# Altium schematic sheet mach.SchDoc
size A
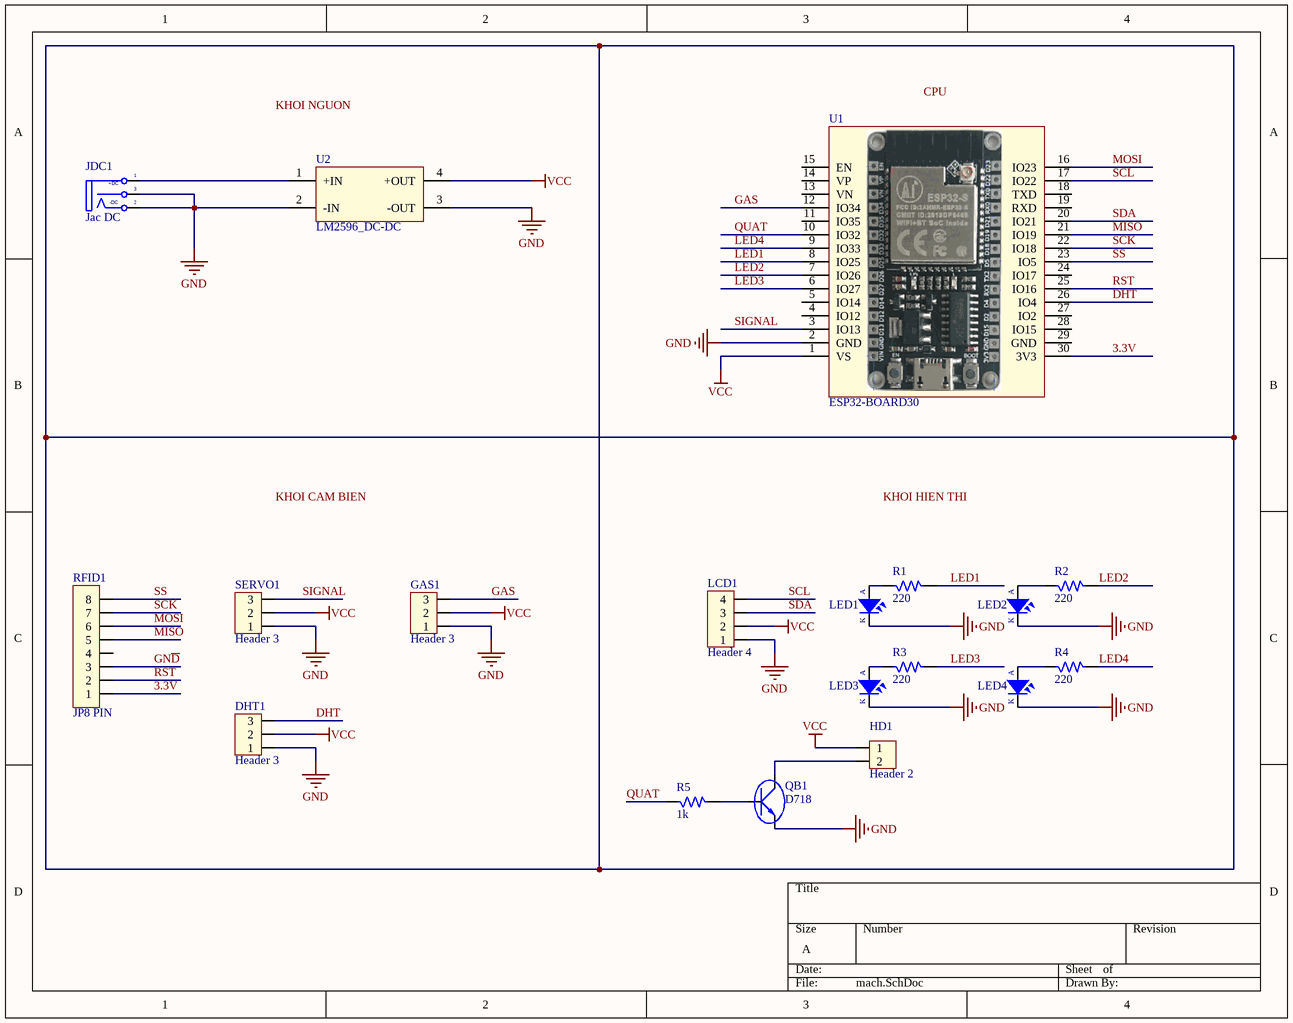
[diagram p0: mach.SchDoc]

## Parts
DHT1  Header 3  [HED3]
GAS1  Header 3  [HED3]
HD1  Header 2  [HED2]
JDC1  Jac DC  [DC-IN]
LCD1  Header 4  [KF8500-4P]
LED1  (no value)  [LED-5]
LED2  (no value)  [LED-5]
LED3  (no value)  [LED-5]
LED4  (no value)  [LED-5]
QB1  D718  [QTO-247]
R1  220  [RM-0805]
R2  220  [RM-0805]
R3  220  [RM-0805]
R4  220  [RM-0805]
R5  1k  [RM-0805]
RFID1  JP8 PIN  [JP8]
SERVO1  Header 3  [HED3]
U1  ESP32-BOARD30  [ESP32-BOARD30-900]
U2  LM2596_DC-DC  [LM2596-DCDC]

## Nets
GND: DHT1.1 GAS1.1 JDC1.2(TN) JDC1.3(S) LCD1.1 LED1.2(K) LED2.2(K) LED3.2(K) LED4.2(K) QB1.3(E) SERVO1.1 U1.2(GND) U2.2(-IN) U2.3(-OUT)
VCC: DHT1.2 GAS1.2 HD1.1 LCD1.2 SERVO1.2 U1.1(VS) U2.4(+OUT)
3.3V: RFID1.1 U1.30(3V3)
DHT: DHT1.3 U1.26(IO4)
GAS: GAS1.3 U1.12(IO34)
GN~{D}: RFID1.3
LED1: R1.2 U1.8(IO25)
LED2: R2.2 U1.7(IO26)
LED3: R3.2 U1.6(IO27)
LED4: R4.2 U1.9(IO33)
MISO: RFID1.5 U1.21(IO19)
MOSI: RFID1.6 U1.16(IO23)
QUAT: R5.1 U1.10(IO32)
RST: RFID1.2 U1.25(IO16)
SCK: RFID1.7 U1.22(IO18)
SCL: LCD1.4 U1.17(IO22)
SDA: LCD1.3 U1.20(IO21)
SIGNAL: SERVO1.3 U1.3(IO13)
SS: RFID1.8 U1.23(IO5)
NetHD1_2: HD1.2 QB1.2(C)
NetJDC1_1: JDC1.1(+DC) U2.1(+IN)
NetLED1_1: LED1.1(A) R1.1
NetLED2_1: LED2.1(A) R2.1
NetLED3_1: LED3.1(A) R3.1
NetLED4_1: LED4.1(A) R4.1
NetQB1_1: QB1.1(B) R5.2

Not connected (* = marked no-connect by the designer): RFID1 4; U1 4(IO12) 5(IO14) 11(IO35) 13(VN) 14(VP) 15(EN) 18(TXD) 19(RXD) 24(IO17) 27(IO2) 28(IO15) 29(GND)

## Notes on the sheet
- Labels drawn without touching a wire or pin: CPU, KHOI CAM BIEN, KHOI HIEN THI, KHOI NGUON
- (in symbol DCIN) -DC

## Library data of the parts
DHT1 GAS1 SERVO1 = Hed3: Header 3 (Green); Value: Header 3
HD1 = Hed2: Header 2 (Green); Value: Header 2
JDC1 = DCIN: Jac DC input; Value: Jac DC
LCD1 = Hed4: Header 4 (Green); Value: Header 4
LED1-LED4 = LED: LED Single colour Green and Red; Value: LED 3 ly Single Colour
QB1 = D718: Transistor Power Supply; Value: D718
R1-R5 = R: Resistor 1/4W; Value: R1/4W - 1K
RFID1 = JP8: Value: JP7
U2 = LM2596S DC-DC: Module LM2596_DC-DC